# Altium schematic sheet 02.Power_path.SchDoc
size A4; SPICEModelCacheOOZADGMI: <root> / <DocumentId>OOZADGMI</DocumentId> / </root>; Organization: Electronic and Telecommunication Department - University of Moratuwa; Address1: Bandaranayake Mawatha; Address2: Moratuwa; Address3: Sri Lanka; Address4: 10400; DocumentNumber: 02; SheetNumber: 2; SheetTotal: 4; Page: Power Path
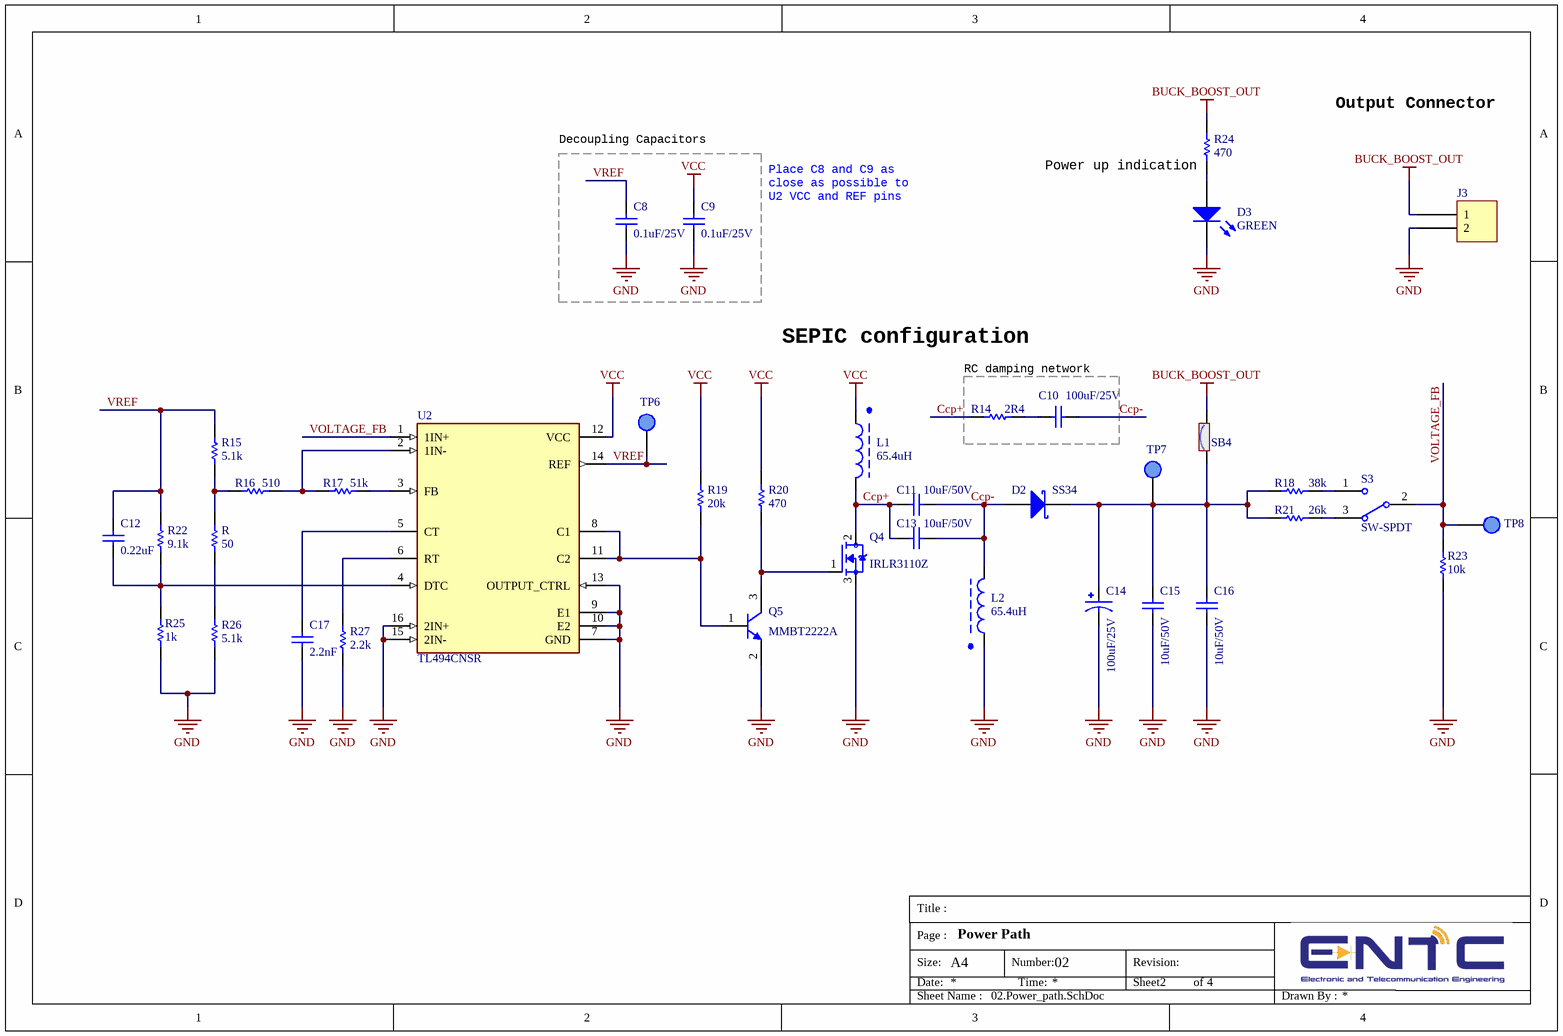
[diagram p0: 02.Power_path.SchDoc]

## Parts
C8  0.1uF/25V  [cap0805]
C9  0.1uF/25V  [cap0805]
C10  100uF/25V  [cap0805]
C11  10uF/50V  [cap0805]
C12  0.22uF  [cap0805]
C13  10uF/50V  [cap0805]
C14  100uF/25V  [CAP_EEEFC0J680P]
C15  10uF/50V  [cap0805]
C16  10uF/50V  [cap0805]
C17  2.2nF  [cap0805]
D2  SS34  [DIO_SS34]
D3  GREEN  [LED0805]
J3  (no value)  [JST XH B2B-XH-A]
L1  65.4uH  [toroid-16x8]
L2  65.4uH  [toroid-16x8]
Q4  IRLR3110Z  [TO252]
Q5  MMBT2222A  [SOT23]
R  50  [RES0402]
R14  2R4  [RES0805]
R15  5.1k  [RES0805]
R16  510  [RES0805]
R17  51k  [RES0805]
R18  38k  [RES0805]
R19  20k  [RES0805]
R20  470  [res1206]
R21  26k  [RES0805]
R22  9.1k  [RES0805]
R23  10k  [RES0805]
R24  470  [RES0805]
R25  1k  [RES0805]
R26  5.1k  [RES0805]
R27  2.2k  [RES0805]
S3  SW-SPDT  [SS12D00G3]
SB4  SB_ON  [SOLDER-BRIDGE_R0805-0R]  (value not drawn)
TP6  VREF  [tp]  (value not drawn)  (no BOM)
TP7  (no value)  [tp]  (no BOM)
TP8  (no value)  [tp]  (no BOM)
U2  TL494CNSR  [SOIC127P780X200-16N]

## Blocks framed on the sheet
Decoupling Capacitors: C8 C9
RC damping network: C10 R14

## Nets
BUCK_BOOST_OUT: J3.1 R24.2 SB4.2
GND: C8.1 C9.1 C14.2 C15.2 C16.2 C17.2 D3.2(K) J3.2 L2.1 Q4.3(S) Q5.2(E) R23.1 R25.1 R26.1 R27.1 U2.7(GND) U2.9(E1) U2.10(E2) U2.13(OUTPUT_CTRL) U2.15(2IN-) U2.16(2IN+)
VCC: C9.2 L1.1 R19.1 R20.2 U2.12(VCC)
Ccp+: C11.2 C13.2 L1.2 Q4.2(D) R14.2
Ccp-: C10.1 C11.1 C13.1 D2.1(A) L2.2
VOLTAGE_FB: R23.2 S3.2 TP8.1(TP) U2.1(1IN+)
VREF: C8.2 C12.1 R15.2 R22.2 TP6.1(TP) U2.14(REF)
NetC10_2: C10.2 R14.1
NetC12_2: C12.2 R22.1 R25.2 U2.4(DTC)
NetC14_1: C14.1 C15.1 C16.1 D2.2(K) R18.2 R21.2 SB4.1 TP7.1(TP)
NetC17_1: C17.1 U2.5(CT)
NetD3_1: D3.1(A) R24.1
NetQ4_1: Q4.1(G) Q5.3(C) R20.1
NetQ5_1: Q5.1(B) R19.2 U2.8(C1) U2.11(C2)
NetR16_1: R16.1 R17.2 U2.2(1IN-)
NetR17_1: R17.1 U2.3(FB)
NetR18_1: R18.1 S3.1
NetR21_1: R21.1 S3.3
NetR27_2: R27.2 U2.6(RT)
NetR_1: R.1 R26.2
NetR_2: R.2 R15.1 R16.2

## Notes on the sheet
- Output Connector
- Power up indication
- Place C8 and C9 as close as possible to U2 VCC and REF pins
- SEPIC configuration
- Title :
- Size:
- Date:
- Page :
- A4
- Number:
- Time:
- Revision:
- Sheet
- of
- Sheet Name :
- Drawn By :

## Library data of the parts
C8 C9 = Cap: Multilayer Ceramic Capacitors MLCC - SMD/SMT KAF21BR71E104KT NEW GLOBAL PN 25V .1uF X A 581-KAF21BR71E104KT; MF: KYOCERA AVX; MP: 08053C104K4Z2A; MOUSER: 581-08053C104K4Z2A
C10 = Cap: Capacitor; MP: *
C11 C13 C15 C16 = Cap: Multilayer Ceramic Capacitors MLCC - SMD/SMT 10 uF 50 VDC 10% 0805 X5R; MF: Murata Electronics; MP: GRM21BR61H106KE43L; MOUSER: 81-GRM21BR61H106KE3L
C12 = Cap: Multilayer Ceramic Capacitors MLCC - SMD/SMT KGM21AR71H224KU NEW GLOBAL PN 50V 0.22uF A 581-KGM21AR71H224KU; MF: KYOCERA AVX; MP: 08055C224KAT2A; MOUSER: 581-08055C224KAT2A
C14 = Cap Pol: Aluminum Electrolytic Capacitors - SMD WCAP-ASLU 100uF 25V 20% SMD/SMT; MP: 865090449009; MF: Wurth Elektronik; MOUSER: 710-865090449009
C17 = Cap: Multilayer Ceramic Capacitors MLCC - SMD/SMT KAM21BR71H222JT NW G LOB PN 50V 2200pF X7 A 581-KAM21BR71H222JT; MF: KYOCERA AVX; MP: 08055C222J4T2A; MOUSER: 581-08055C222J4T2A
D2 = D Schottky: Schottky Diodes & Rectifiers 40V 3A; MP: B340-13-F; MF: Diodes Incorporated; MOUSER: 621-B340-F
D3 = LED: Standard LEDs - SMD Ultra Green, 574nm 2.2V, 45mcd; MP: SML-LX0805SUGC-TR; MF: Lumex; MOUSER: 696-SML-0805SUGCTR
J3 = NC6-P108-02: Barrier Terminal Blocks NC6-P108-02; MF: TE Connectivity; MP: NC6-P108-02; MOUSER: 571-314376640
L1 L2 = Inductor-ferrite core: Inductor
Q4 = IRLR3110Z: MOSFETs MOSFT 100V 63A 14mOhm 34nC Log Lvl; MP: IRLR3110ZTRLPBF; MF: Infineon Technologies; MOUSER: 942-IRLR3110ZTRLPBF
Q5 = NPN: Bipolar Transistors - BJT BJT, SOT-23, 40V, 600mA, NPN; MF: Diotec Semiconductor; MP: MMBT2222A; MOUSER: 637-MMBT2222A
R = Res: Resistor; Manufacturer: *; Manufacturer part number: *; JLCPCB part number: *
R14 = Res: Thick Film Resistors - SMD 1/4W 0.05 2.4R; MP: CRCW08052R40FKEA; MF: Vishay / Dale; MOUSER: 71-CRCW08052R40FKEA
R15 R26 = Res: Thick Film Resistors - SMD 5.1Kohms 1% 100ppm; MP: RCA08055K10FKEA; MF: Vishay / Draloric; MOUSER: 71-RCA08055K10FKEA
R16 = Res: Thick Film Resistors - SMD 510ohm 5%; MP: CR0805-JW-511ELF; MF: Bourns; MOUSER: 652-CR0805JW-511ELF
R17 = Res: Thick Film Resistors - SMD 51K 1%; MP: CR0805-FX-5102ELF; MF: Bourns; MOUSER: 652-CR0805FX-5102ELF
R18 = Res: Thick Film Resistors - SMD CRCW0805 38K 1% 100 RT1; MP: CRCW080538K0FKTA; MF: Vishay / Dale; MOUSER: 71-CRCW080538K0FKTA
R19 = Res: Thick Film Resistors - SMD 20K 1%; MP: CR0805-FX-2002ELF; MF: Bourns; MOUSER: 652-CR0805FX-2002ELF
R20 = Res: Thick Film Resistors - SMD 470ohm 5%; MP: CR1206-JW-471ELF; MF: Bourns; MOUSER: 652-CR1206JW-471ELF
R21 = Res: Thick Film Resistors - SMD 26.1K 1%; MP: CR0805-FX-2612ELF; MF: Bourns; MOUSER: 652-CR0805FX-2612ELF
R22 = Res: Thick Film Resistors - SMD 9.1K 1%; MP: CR0805-FX-9101ELF; MF: Bourns; MOUSER: 652-CR0805FX-9101ELF
R23 = Res: Thin Film Resistors - SMD ResThinFilm 0805 10kR 0.5% 125mW TC25; MP: CRT0805ADY-1002ELF; MF: Bourns; MOUSER: 652-CRT0805ADY-1002E
R24 = Res: Thick Film Resistors - SMD 470ohm 5%; MP: CR0805-JW-471ELF; MF: Bourns; MOUSER: 652-CR0805JW-471EL
R25 = Res: Thick Film Resistors - SMD 1 kOhms 125 mW 0805 1%; MP: RC0805FR-071KL; MF: YAGEO; MOUSER: 603-RC0805FR-071KL
R27 = Res: Thin Film Resistors - SMD 2.2K ohm 1% 50 ppm Thin Film; MP: RT0805FRE132K2L; MF: YAGEO; MOUSER: 603-RT0805FRE132K2L
S3 = SW-SPDT: SPDT switch
SB4 = SB_ON: Solder Bridge ON; MP: CR0805AJ/-000EAS; MF: Bourns; MOUSER: 652-CR0805AJ/-000EAS
TP6-TP8 = TP: Test Point
U2 = TL494CNSR: Switching Controllers PWM Controller; MF: Texas Instruments; MP: TL494CNSR; MOUSER: 595-TL494CNSR